# Altium schematic sheet Block Diagram.SchDoc
size A3; ApprovedBy: OLD SCHOOL; CheckedBy: UDEMY; Revision: AA; SheetNumber: 2; SheetTotal: 5; preparedBy: M.Mesih ÇELİK; Department: R&D- Hardware; ReleaseDate: 06.09.2021; ChangedDate: 13.09.2021; Size: A3; RreparedBy: M.Mesih ÇELİK; BoardDescription: Wireless Security Detector
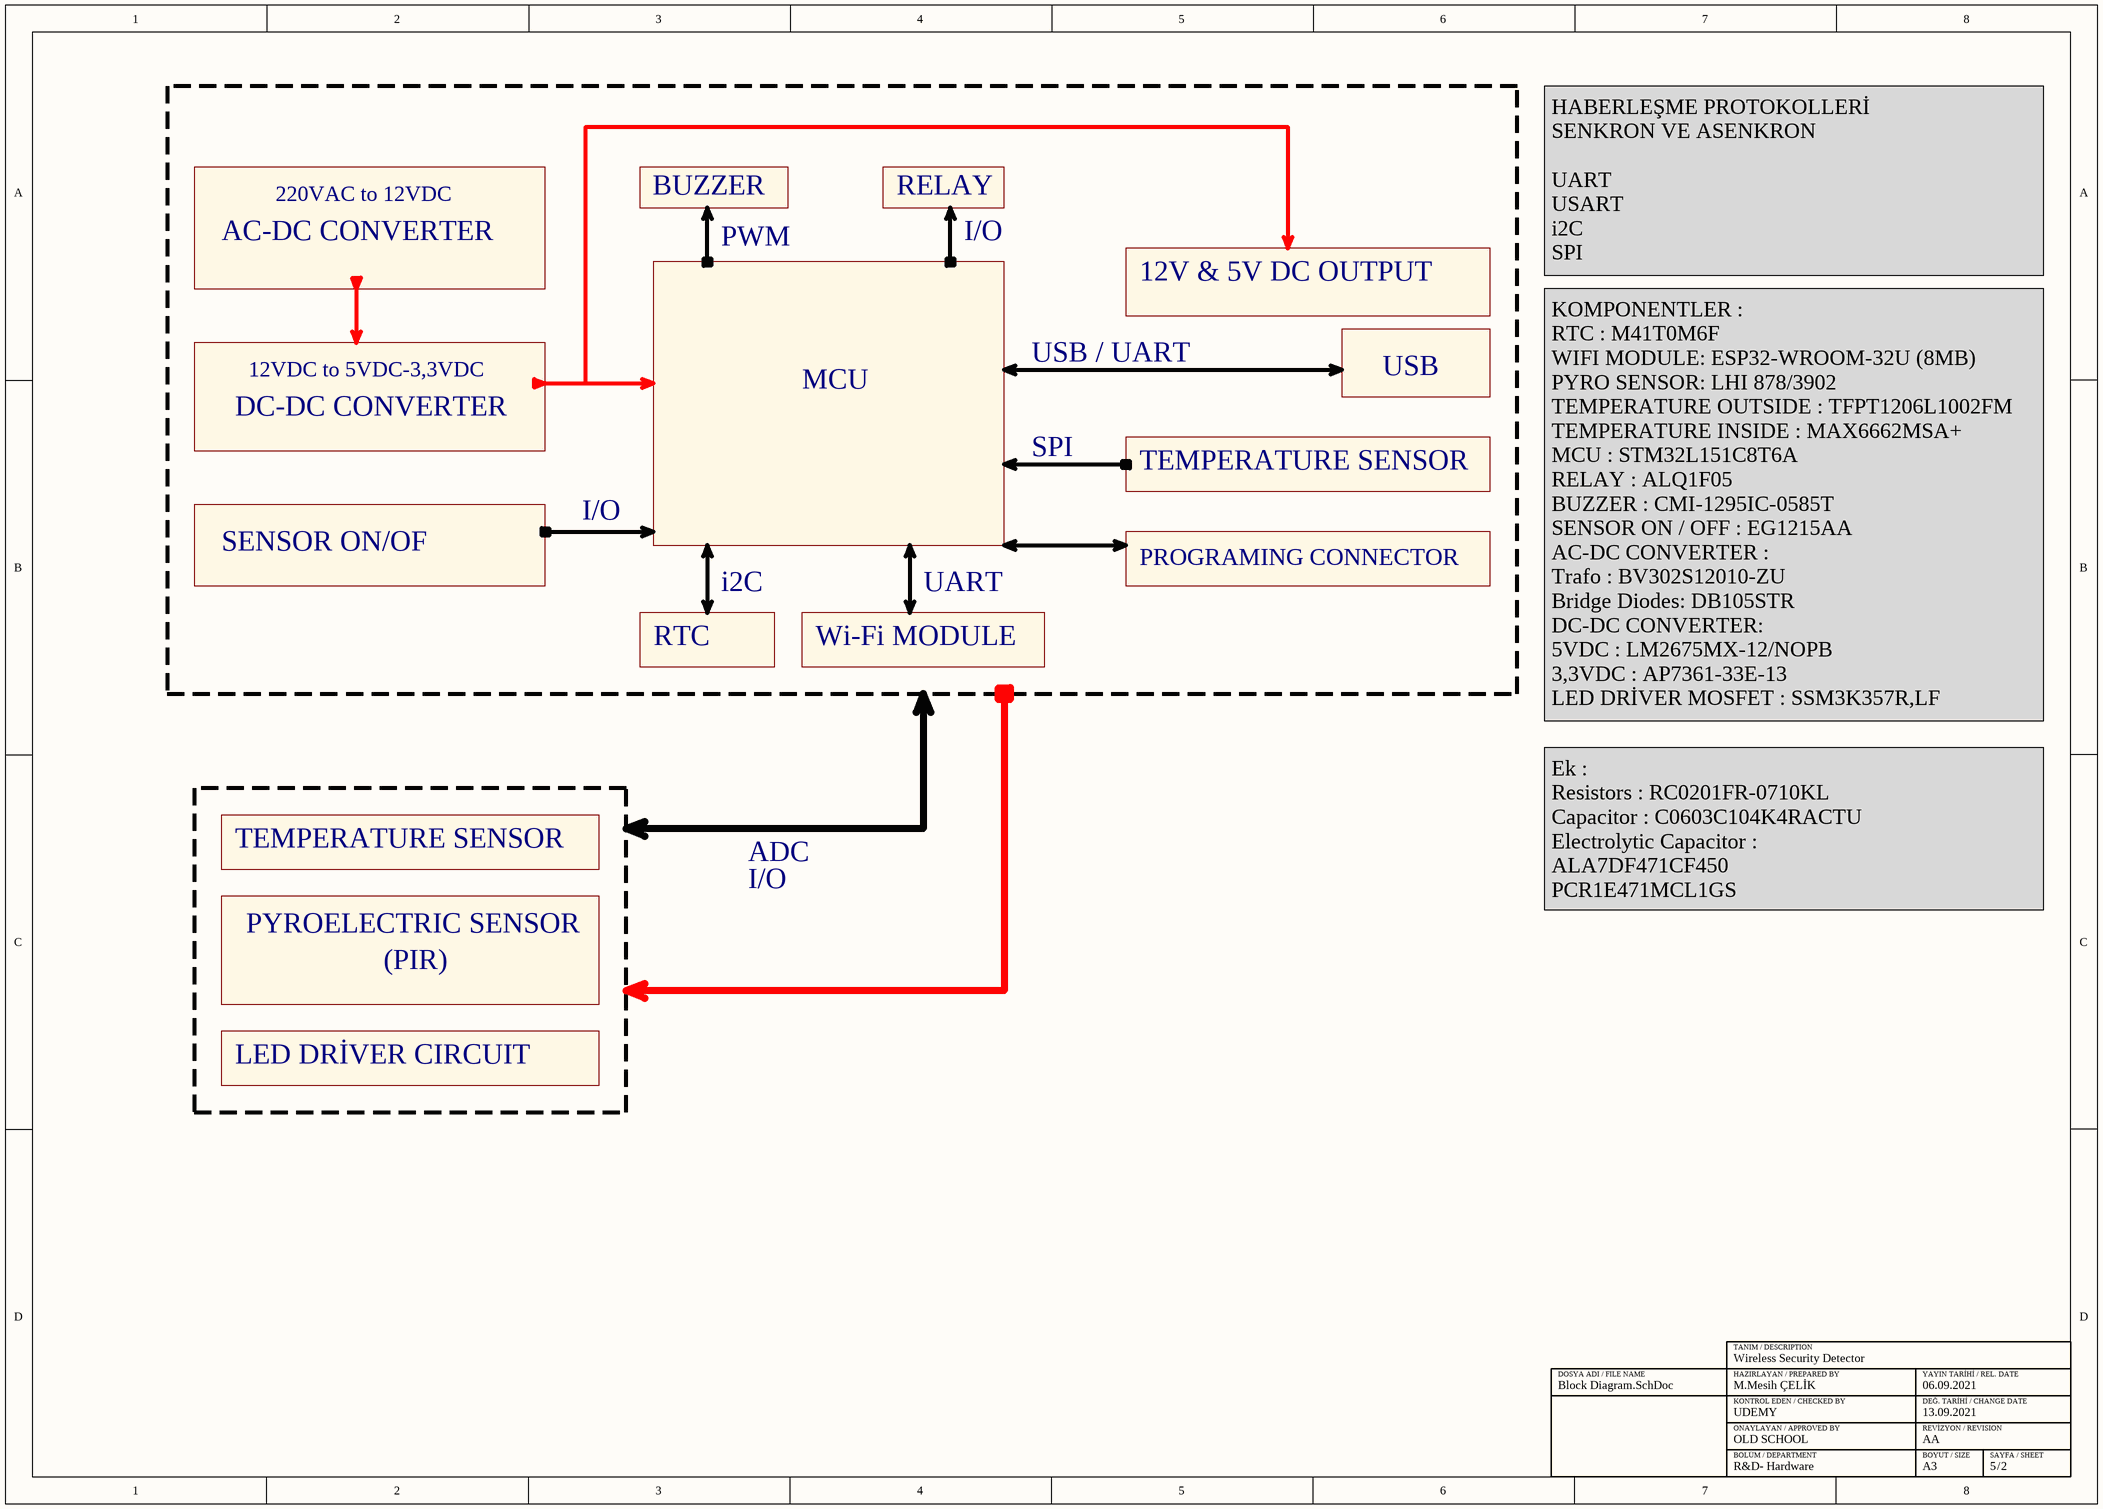
[diagram p0: Block Diagram.SchDoc]

## Notes on the sheet
- AC-DC CONVERTER
- 220VAC to 12VDC
- BUZZER
- PWM
- RELAY
- I/O
- 12V & 5V DC OUTPUT
- HABERLEŞME PROTOKOLLERİ
  SENKRON VE ASENKRON
  UART
  USART
  i2C
  SPI
- 12VDC to 5VDC-3,3VDC
- USB / UART
- USB
- DC-DC CONVERTER
- MCU
- SPI
- TEMPERATURE SENSOR
- SENSOR ON/OF
- PROGRAMING CONNECTOR
- RTC
- i2C
- Wi-Fi MODULE
- UART
- KOMPONENTLER :
  RTC : M41T0M6F
  WIFI MODULE: ESP32-WROOM-32U (8MB)
  PYRO SENSOR: LHI 878/3902
  TEMPERATURE OUTSIDE : TFPT1206L1002FM
  TEMPERATURE INSIDE : MAX6662MSA+
  MCU : STM32L151C8T6A
  RELAY : ALQ1F05
  BUZZER : CMI-1295IC-0585T
  SENSOR ON / OFF : EG1215AA
  AC-DC CONVERTER :
  Trafo : BV302S12010-ZU
  Bridge Diodes: DB105STR
  DC-DC CONVERTER:
  5VDC : LM2675MX-12/NOPB
  3,3VDC : AP7361-33E-13
  LED DRİVER MOSFET : SSM3K357R,LF
- ADC
- Ek :
  Resistors : RC0201FR-0710KL
  Capacitor : C0603C104K4RACTU
  Electrolytic Capacitor :
  ALA7DF471CF450
  PCR1E471MCL1GS
- PYROELECTRIC SENSOR
- (PIR)
- LED DRİVER CIRCUIT
- DOSYA ADI / FILE NAME
- TANIM / DESCRIPTION
- HAZIRLAYAN / PREPARED BY
- YAYIN TARİHİ / REL. DATE
- ONAYLAYAN / APPROVED BY
- KONTROL EDEN / CHECKED BY
- BÖLÜM / DEPARTMENT
- BOYUT / SIZE
- DEĞ. TARİHİ / CHANGE DATE
- REVİZYON / REVISION
- SAYFA / SHEET
- /